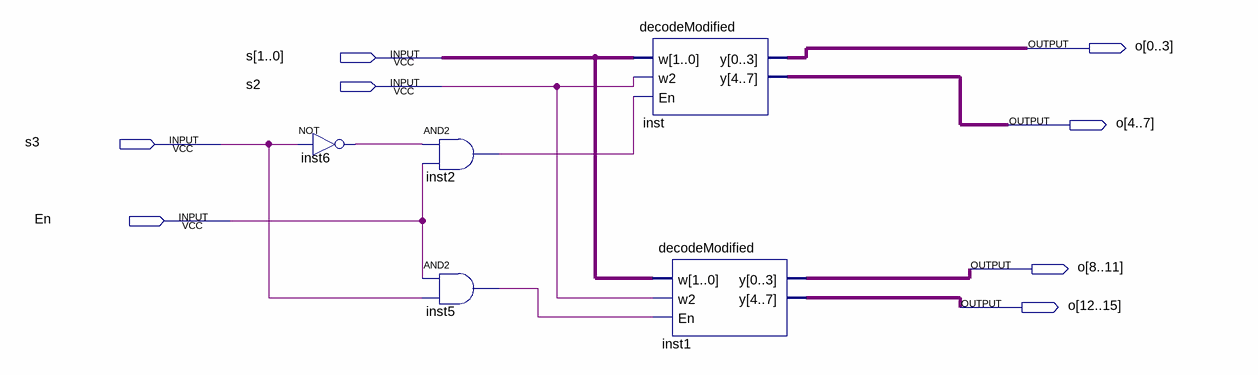
[diagram p0: schematic sheet]
// Quartus schematic 4x16decode.bdf as structural Verilog: 5 symbols, 8 pins
module \4x16decode  (
  input  [1:0] s,
  input  s2,
  input  s3,
  input  En,
  output [0:15] o
);

  wire inst2_out, inst5_out, inst6_out;

  not inst6 (inst6_out, s3);
  and inst2 (inst2_out, inst6_out, En);
  and inst5 (inst5_out, En, s3);
  decodeModified inst (.w(s), .w2(s2), .En(inst2_out), .y({o[7], o[6], o[5], o[4], o[3], o[2], o[1], o[0]}));
  decodeModified inst1 (.w(s), .w2(s2), .En(inst5_out), .y({o[15], o[14], o[13], o[12], o[11], o[10], o[9], o[8]}));
endmodule
